# EAGLE design RGB LED 1.0 (EAGLE 5.04)
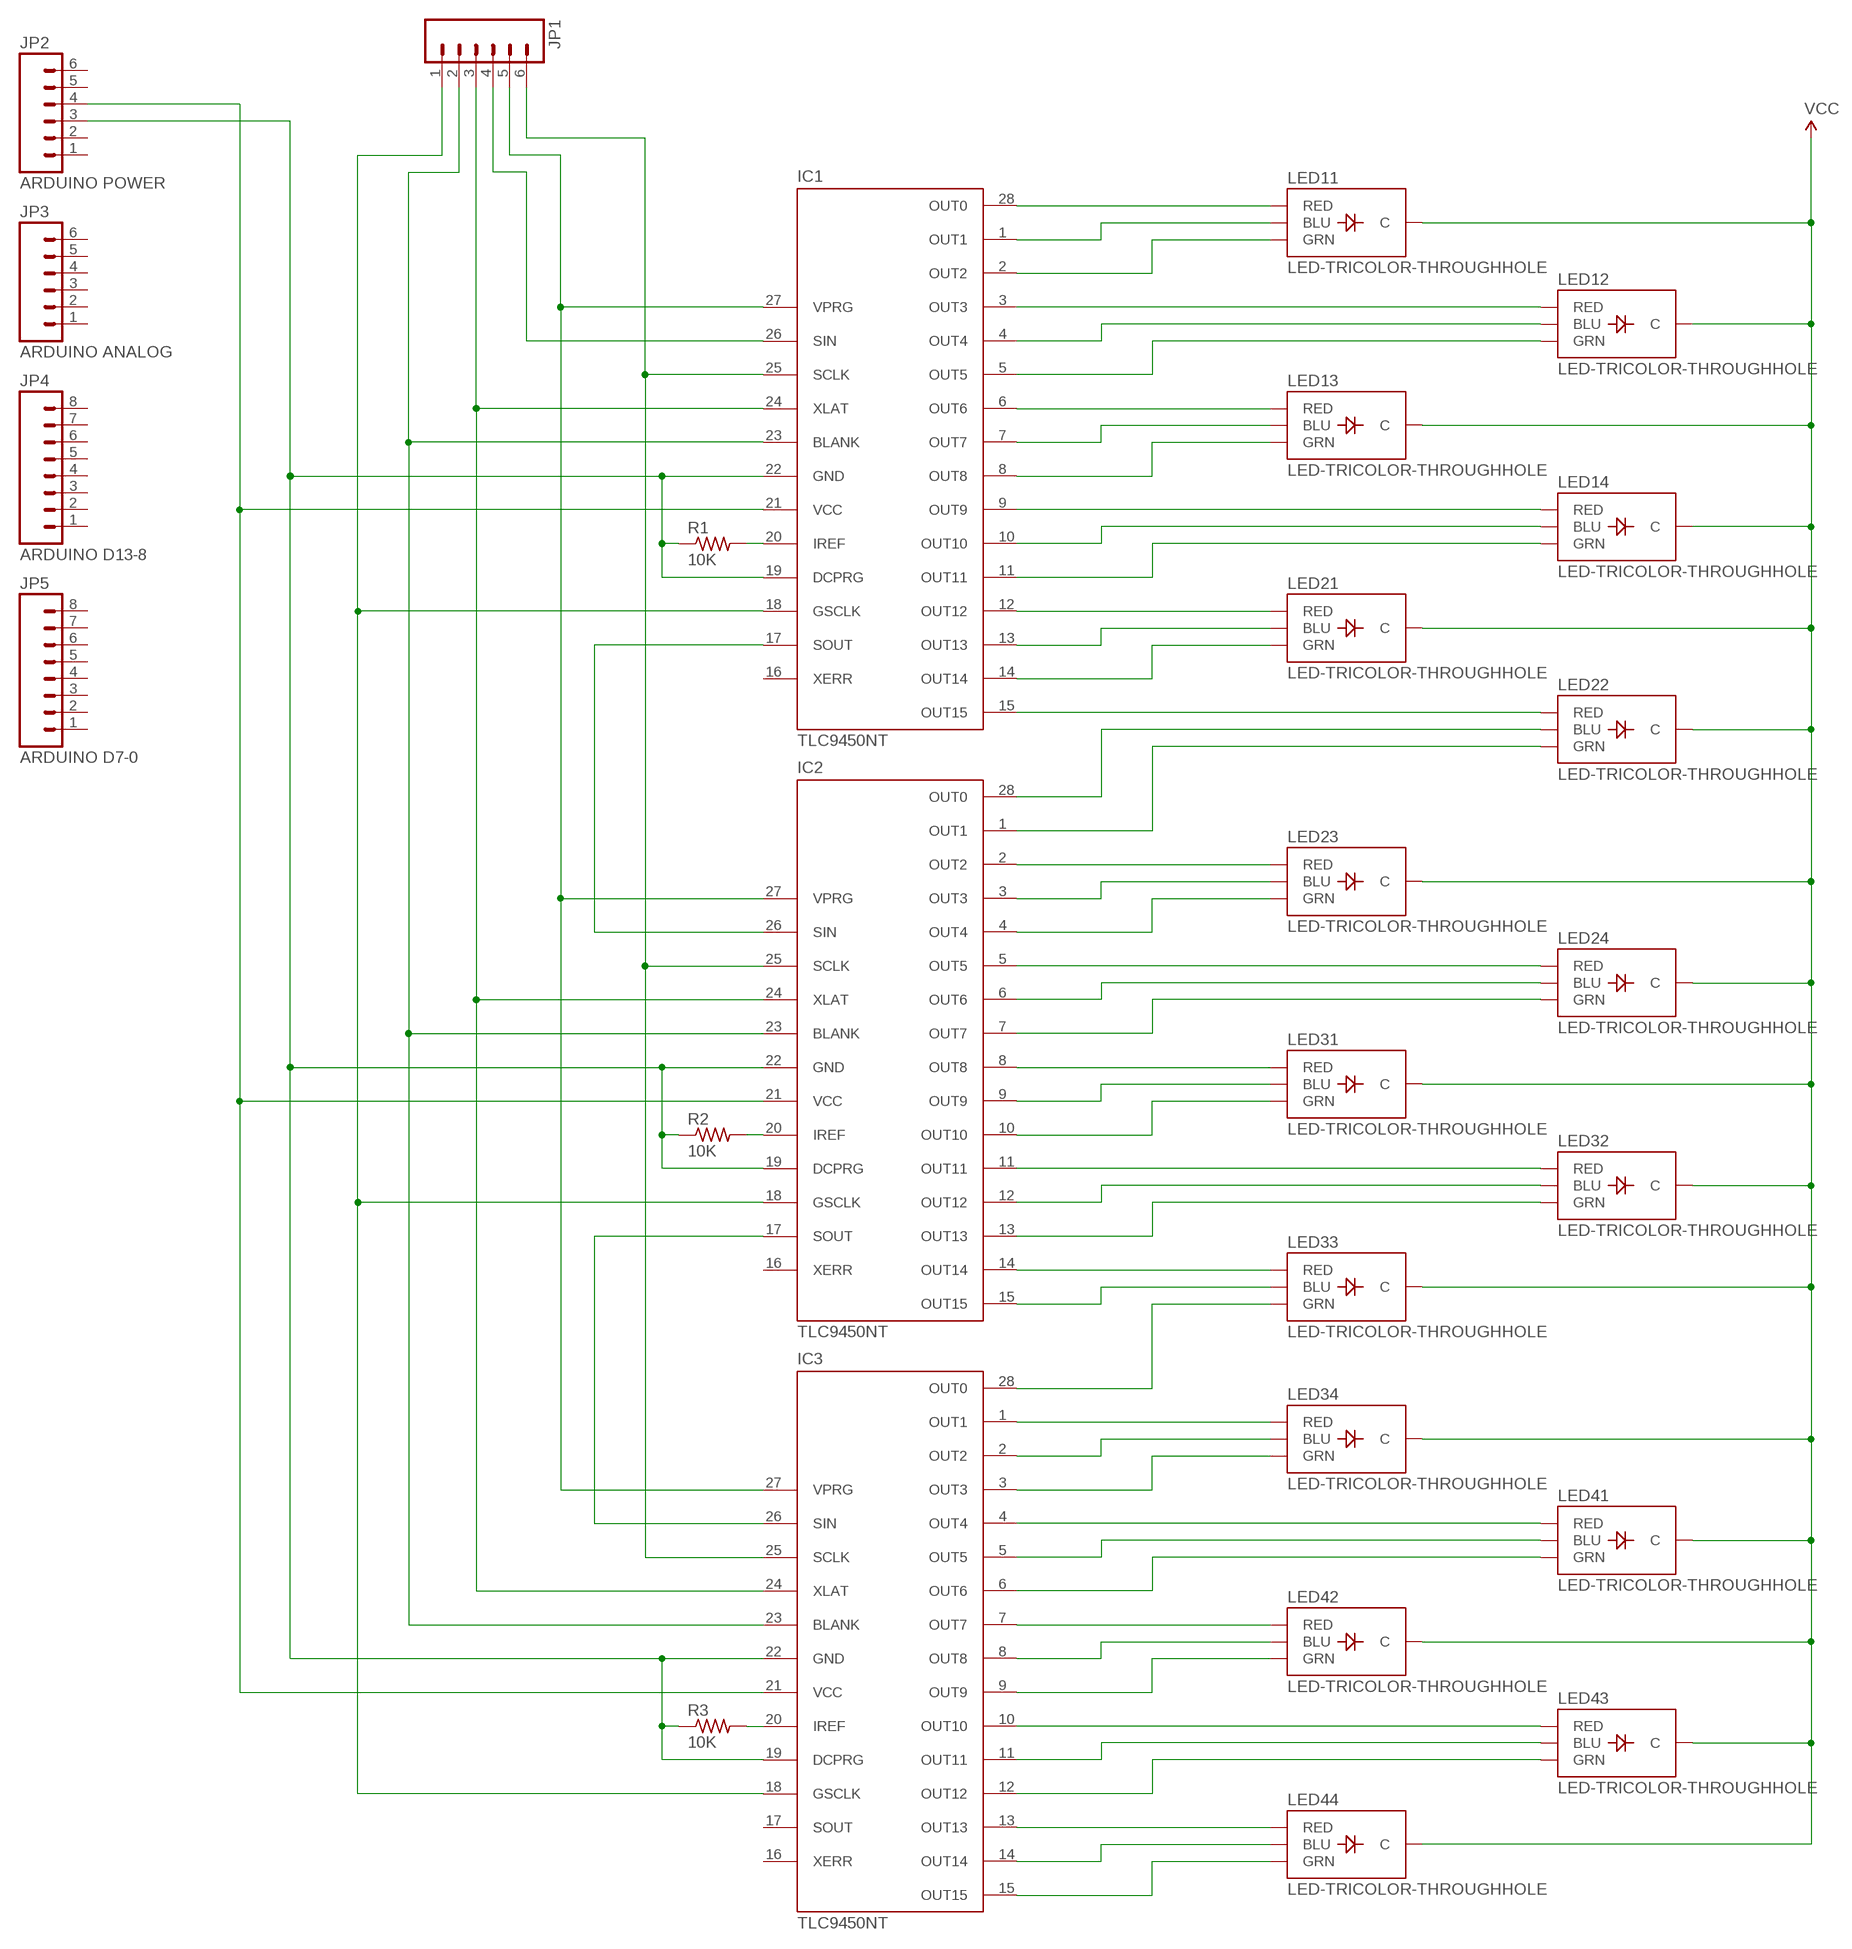
[diagram p0: schematic, sheet 1]

## Parts
IC1  TLC9450NT  [DIL28-3]
IC2  TLC9450NT  [DIL28-3]
IC3  TLC9450NT  [DIL28-3]
JP1  M06LOCK_LONGPADS  [1X06_LOCK_LONGPADS]
JP2  ARDUINO POWER  M06LOCK  [1X06_LOCK]
JP3  ARDUINO ANALOG  M06LOCK  [1X06_LOCK]
JP4  ARDUINO D13-8  M08LOCK  [1X08_LOCK]
JP5  ARDUINO D7-0  M08LOCK  [1X08_LOCK]
LED11  LED-TRICOLOR-THROUGHHOLE  [LED-TRICOLOR-THROUGHHOLE]
LED12  LED-TRICOLOR-THROUGHHOLE  [LED-TRICOLOR-THROUGHHOLE]
LED13  LED-TRICOLOR-THROUGHHOLE  [LED-TRICOLOR-THROUGHHOLE]
LED14  LED-TRICOLOR-THROUGHHOLE  [LED-TRICOLOR-THROUGHHOLE]
LED21  LED-TRICOLOR-THROUGHHOLE  [LED-TRICOLOR-THROUGHHOLE]
LED22  LED-TRICOLOR-THROUGHHOLE  [LED-TRICOLOR-THROUGHHOLE]
LED23  LED-TRICOLOR-THROUGHHOLE  [LED-TRICOLOR-THROUGHHOLE]
LED24  LED-TRICOLOR-THROUGHHOLE  [LED-TRICOLOR-THROUGHHOLE]
LED31  LED-TRICOLOR-THROUGHHOLE  [LED-TRICOLOR-THROUGHHOLE]
LED32  LED-TRICOLOR-THROUGHHOLE  [LED-TRICOLOR-THROUGHHOLE]
LED33  LED-TRICOLOR-THROUGHHOLE  [LED-TRICOLOR-THROUGHHOLE]
LED34  LED-TRICOLOR-THROUGHHOLE  [LED-TRICOLOR-THROUGHHOLE]
LED41  LED-TRICOLOR-THROUGHHOLE  [LED-TRICOLOR-THROUGHHOLE]
LED42  LED-TRICOLOR-THROUGHHOLE  [LED-TRICOLOR-THROUGHHOLE]
LED43  LED-TRICOLOR-THROUGHHOLE  [LED-TRICOLOR-THROUGHHOLE]
LED44  LED-TRICOLOR-THROUGHHOLE  [LED-TRICOLOR-THROUGHHOLE]
R1  10K  R-US_0309/12  [0309/12]
R2  10K  R-US_0309/12  [0309/12]
R3  10K  R-US_0309/12  [0309/12]

## Nets
BLANK: IC1.23(BLANK) IC2.23(BLANK) IC3.23(BLANK) JP1.2
GND: IC1.19(DCPRG) IC1.22(GND) IC2.19(DCPRG) IC2.22(GND) IC3.19(DCPRG) IC3.22(GND) JP2.3 R1.1 R2.1 R3.1
GSCLK: IC1.18(GSCLK) IC2.18(GSCLK) IC3.18(GSCLK) JP1.1
N$1: IC1.17(SOUT) IC2.26(SIN)
N$2: IC2.17(SOUT) IC3.26(SIN)
N$3: IC1.28(OUT0) LED11.RED
N$4: IC3.20(IREF) R3.2
N$5: IC2.20(IREF) R2.2
N$6: IC1.20(IREF) R1.2
N$7: IC1.1(OUT1) LED11.BLU
N$8: IC1.2(OUT2) LED11.GRN
N$9: IC1.3(OUT3) LED12.RED
N$10: IC1.4(OUT4) LED12.BLU
N$11: IC1.5(OUT5) LED12.GRN
N$12: IC1.6(OUT6) LED13.RED
N$13: IC1.7(OUT7) LED13.BLU
N$14: IC1.8(OUT8) LED13.GRN
N$16: IC1.10(OUT10) LED14.BLU
N$17: IC1.11(OUT11) LED14.GRN
N$18: IC1.12(OUT12) LED21.RED
N$19: IC1.13(OUT13) LED21.BLU
N$20: IC1.14(OUT14) LED21.GRN
N$21: IC1.15(OUT15) LED22.RED
N$22: IC2.28(OUT0) LED22.BLU
N$23: IC2.1(OUT1) LED22.GRN
N$24: IC2.2(OUT2) LED23.RED
N$25: IC2.3(OUT3) LED23.BLU
N$26: IC2.4(OUT4) LED23.GRN
N$27: IC2.5(OUT5) LED24.RED
N$28: IC2.6(OUT6) LED24.BLU
N$29: IC2.7(OUT7) LED24.GRN
N$30: IC2.8(OUT8) LED31.RED
N$31: IC2.9(OUT9) LED31.BLU
N$32: IC2.10(OUT10) LED31.GRN
N$33: IC2.11(OUT11) LED32.RED
N$34: IC2.12(OUT12) LED32.BLU
N$35: IC2.13(OUT13) LED32.GRN
N$36: IC2.14(OUT14) LED33.RED
N$37: IC2.15(OUT15) LED33.BLU
N$38: IC3.28(OUT0) LED33.GRN
N$39: IC3.1(OUT1) LED34.RED
N$40: IC3.2(OUT2) LED34.BLU
N$41: IC3.3(OUT3) LED34.GRN
N$42: IC3.4(OUT4) LED41.RED
N$43: IC3.5(OUT5) LED41.BLU
N$44: IC3.6(OUT6) LED41.GRN
N$45: IC3.7(OUT7) LED42.RED
N$46: IC3.8(OUT8) LED42.BLU
N$47: IC3.9(OUT9) LED42.GRN
N$48: IC3.10(OUT10) LED43.RED
N$49: IC3.11(OUT11) LED43.BLU
N$50: IC3.12(OUT12) LED43.GRN
N$51: IC3.13(OUT13) LED44.RED
N$52: IC3.14(OUT14) LED44.BLU
N$53: IC3.15(OUT15) LED44.GRN
NS$15: IC1.9(OUT9) LED14.RED
SCLK: IC1.25(SCLK) IC2.25(SCLK) IC3.25(SCLK) JP1.6
SIN: IC1.26(SIN) JP1.4
VCC: IC1.21(VCC) IC2.21(VCC) IC3.21(VCC) JP2.4 LED11.GND(C) LED12.GND(C) LED13.GND(C) LED14.GND(C) LED21.GND(C) LED22.GND(C) LED23.GND(C) LED24.GND(C) LED31.GND(C) LED32.GND(C) LED33.GND(C) LED34.GND(C) LED41.GND(C) LED42.GND(C) LED43.GND(C) LED44.GND(C)
VPRG: IC1.27(VPRG) IC2.27(VPRG) IC3.27(VPRG) JP1.5
XLAT: IC1.24(XLAT) IC2.24(XLAT) IC3.24(XLAT) JP1.3
Unconnected: IC1.16(XERR) IC2.16(XERR) IC3.16(XERR) IC3.17(SOUT) JP2.1 JP2.2 JP2.5 JP2.6 JP3.1 JP3.2 JP3.3 JP3.4 JP3.5 JP3.6 JP4.1 JP4.2 JP4.3 JP4.4 JP4.5 JP4.6 JP4.7 JP4.8 JP5.1 JP5.2 JP5.3 JP5.4 JP5.5 JP5.6 JP5.7 JP5.8

## Library data of the parts
IC1-IC3 = combee:TLC9450NT: TI TLC5940 16 Channel LED Driver
JP1-JP3 = SparkFun:M06: Header 6 Standard 6-pin 0.1" header. Use with straight break away headers (SKU : PRT-00116), right angle break away headers (PRT-00553), swiss pins (PRT-00743), machine pins (PRT-00117), and female headers (PRT-00115). Molex polarized connector foot print use with SKU : PRT-08094 with associated crimp pins and housings. NOTES ON THE VARIANTS LOCK and LOCK_LONGPADS... This footprint was designed to help hold the alignment of a through-hole component (i.e. 6-pin header) while soldering it into place. You may notice that each hole has been shifted either up or down by 0.005 of an inch from it's more standard position (which is a perfectly straight line). This slight alteration caused the pins (the squares in the middle) to touch the edges of the holes. Because they are alternating, it causes a "brace" to hold the component in place. 0.005 has proven to be the perfect amount of "off-center" position when using our standard breakaway headers. Although looks a little odd when you look at the bare footprint, once you have a header in there, the alteration is very hard to notice. Also, if you push a header all the way into place, it is covered up entirely on the bottom side. This idea of altering the position of holes to aid alignment will be further integrated into the Sparkfun Library for other footprints. It can help hold any component with 3 or more connection pins.
JP4 JP5 = SparkFun:M08: Header 8 Standard 8-pin 0.1" header. Use with straight break away headers (SKU : PRT-00116), right angle break away headers (PRT-00553), swiss pins (PRT-00743), machine pins (PRT-00117), and female headers (PRT-00115).
LED11-LED14 LED21-LED24 LED31-LED34 LED41-LED44 = SparkFun:LED-TRICOLOR-THROUGHHOLE
R1-R3 = resistor:R-US_: RESISTOR, American symbol

## Board
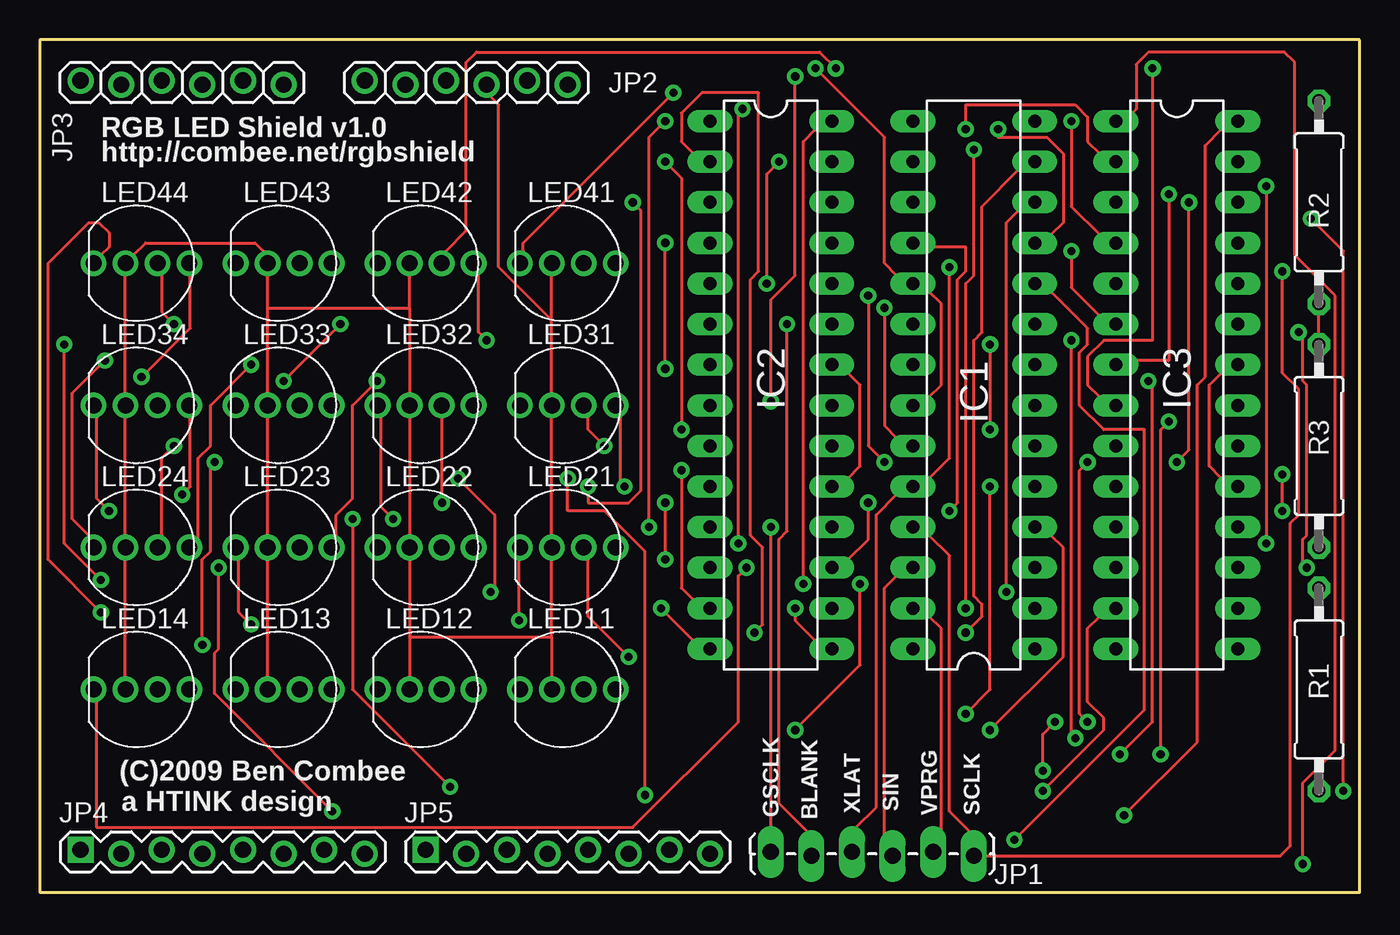
[diagram p1: board, top side]
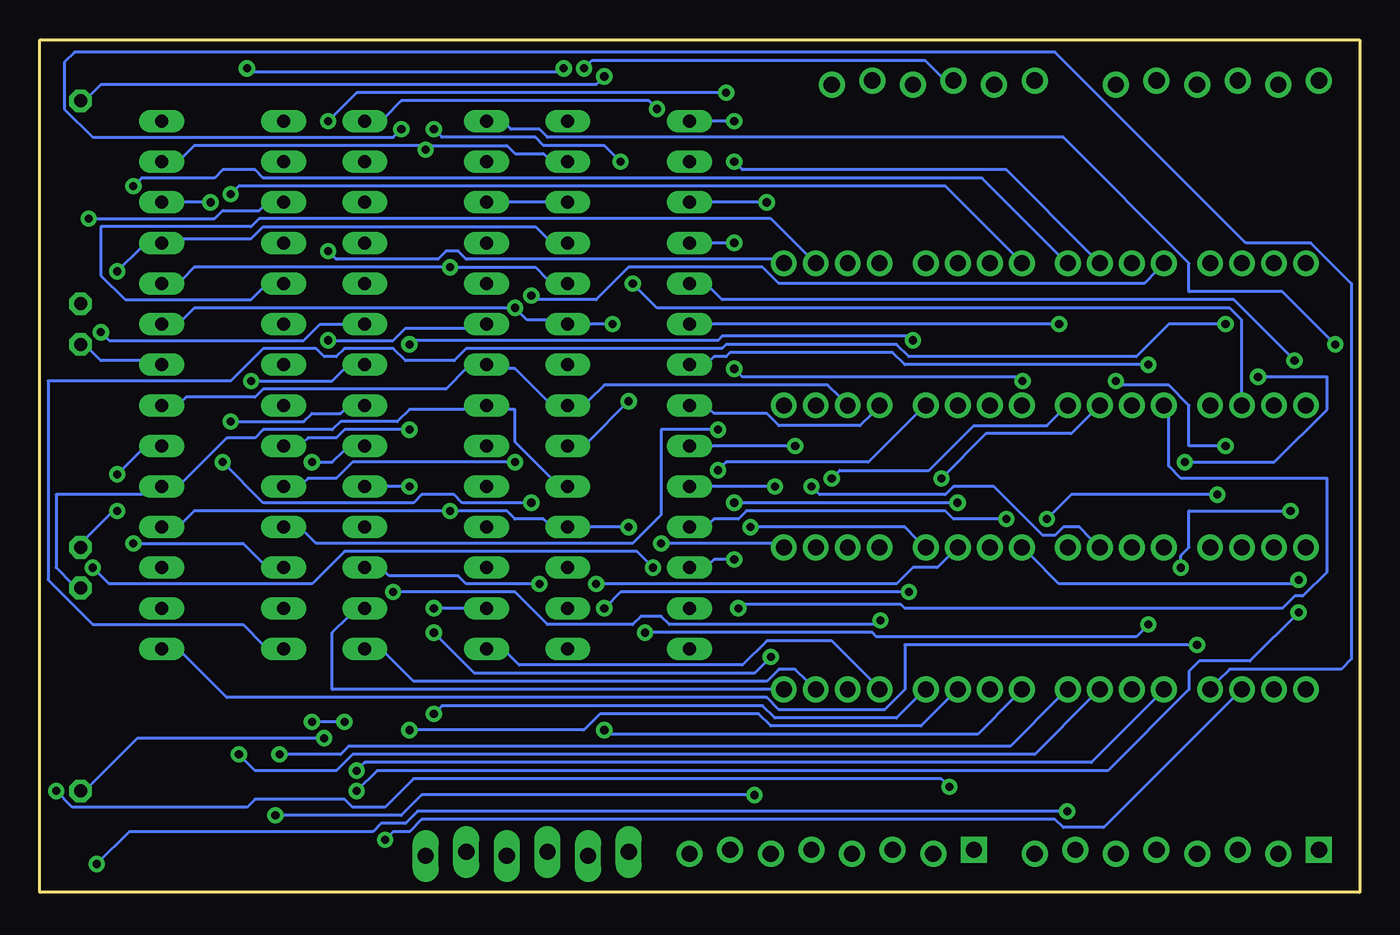
[diagram p2: board, bottom side, seen from below]

Size 82.55 x 53.34 mm. Coordinates in mm from the lower left corner, seen from the top.
Outline: 0,0 82.55,0 82.55,53.34 0,53.34 0,0
Copper layers (1*16): Top 0.035mm / dielectric 1.5mm / Bottom 0.035mm
Design rules "SparkFun": minimum track width 8mil, minimum drill 20mil, track to track 8mil, track to pad 8mil, pad to pad 8mil, via to via 8mil, smd to smd 8mil, copper to edge 10mil, drill to drill 8mil, minimum pad ring 12mil, minimum via ring 10mil, stop-mask expansion 4mil, vias tented up to drill 25mil, thermal gap 10mil

### Footprints (pad centres in the part's own frame; a part is rotated, then mirrored left to right if it is on the bottom)
DIL28-3 = drill 0.813 long: 1 -16.51,-3.81; 2 -13.97,-3.81; 3 -11.43,-3.81; 4 -8.89,-3.81; 5 -6.35,-3.81; 6 -3.81,-3.81; 7 -1.27,-3.81; 8 1.27,-3.81; 9 3.81,-3.81; 10 6.35,-3.81; 11 8.89,-3.81; 12 11.43,-3.81; 13 13.97,-3.81; 14 16.51,-3.81; 15 16.51,3.81; 16 13.97,3.81; 17 11.43,3.81; 18 8.89,3.81; 19 6.35,3.81; 20 3.81,3.81; 21 1.27,3.81; 22 -1.27,3.81; 23 -3.81,3.81; 24 -6.35,3.81; 25 -8.89,3.81; 26 -11.43,3.81; 27 -13.97,3.81; 28 -16.51,3.81
1X06_LOCK_LONGPADS = drill 1.016 long: 1 0,0; 2 2.54,-0.254; 3 5.08,0; 4 7.62,-0.254; 5 10.16,0; 6 12.7,-0.254
1X06_LOCK = drill 1.016 round: 1 0,0; 2 2.54,-0.254; 3 5.08,0; 4 7.62,-0.254; 5 10.16,0; 6 12.7,-0.254
1X08_LOCK = drill 1.016 square: 1 0,0.127 | drill 1.016 round: 2 2.54,-0.127; 3 5.08,0.127; 4 7.62,-0.127; 5 10.16,0.127; 6 12.7,-0.127; 7 15.24,0.127; 8 17.78,-0.127
LED-TRICOLOR-THROUGHHOLE = drill 1 round: BLU 1,0; GND -1,0; GRN 3,0; RED -3,0
0309/12 = drill 0.813 octagon: 1 -6.35,0; 2 6.35,0

### Placement (x,y rotation side)
IC1  58.42,31.75 90 top
IC2  45.72,31.75 270 top
IC3  71.12,31.75 270 top
JP1  45.72,2.54 0 top
JP2  20.32,50.8 0 top
JP3  2.54,50.8 0 top
JP4  2.54,2.54 0 top
JP5  24.13,2.54 0 top
LED11  33.02,12.7 0 top
LED12  24.13,12.7 0 top
LED13  15.24,12.7 0 top
LED14  6.35,12.7 0 top
LED21  33.02,21.59 0 top
LED22  24.13,21.59 0 top
LED23  15.24,21.59 0 top
LED24  6.35,21.59 0 top
LED31  33.02,30.48 0 top
LED32  24.13,30.48 0 top
LED33  15.24,30.48 0 top
LED34  6.35,30.48 0 top
LED41  33.02,39.37 0 top
LED42  24.13,39.37 0 top
LED43  15.24,39.37 0 top
LED44  6.35,39.37 0 top
R1  80.01,12.7 270 top
R2  80.01,43.18 90 top
R3  80.01,27.94 270 top

### Tracks (layer width: path | path; a pad name or v marks a point on that pad's centre or on a via)
BLANK  (via drill 0.51)
  Top 0.203: v52.83,36.58 52.83,29.21 53.59,28.45 IC1.23 | v46.74,35.56 46.74,22.61 46.23,22.1 46.23,5.59 48.01,3.81 JP1.2
  Bottom 0.203: IC3.23 73.66,35.81 72.9,36.58 v52.83,36.58 52.07,35.81 50.8,35.81 IC2.23 v46.74,35.56
GND  (via drill 0.51)
  Top 0.203: R3.1 R2.1 | IC3.19 73.91,25.91 73.15,26.67 73.15,31.75 73.91,32.51 IC3.22 | IC2.22 50.55,32.51 51.31,31.75 51.31,26.67 50.55,25.91 IC2.19 | IC1.22 55.63,30.99 56.39,31.75 56.39,36.83 55.63,37.59 IC1.19 53.59,38.61 52.83,39.37 52.83,47.24 v48.51,51.56
  Bottom 0.203: R1.1 80.52,19.3 81.53,20.32 81.53,24.89 75.95,24.89 IC3.19 73.66,25.65 70.87,28.45 69.09,28.45 68.58,28.96 64.26,28.96 63.75,29.46 60.2,29.46 59.44,30.23 55.88,30.23 IC1.22 53.34,30.23 52.83,30.23 52.83,28.19 50.55,25.91 IC2.19 | R3.1 79.5,34.04 78.74,33.27 76.2,33.27 IC3.22 | v48.51,51.56 48.01,52.07 27.18,52.07 26.16,51.05 JP2.3
GSCLK  (via drill 0.51)
  Top 0.203: v56.9,23.88 57.4,24.38 57.4,38.35 57.91,38.86 57.91,40.39 55.88,40.39 IC1.18 | JP1.1 v45.72,22.86
  Bottom 0.203: IC3.18 73.66,23.11 72.9,23.88 v56.9,23.88 53.34,23.88 52.83,23.37 51.05,23.37 50.8,23.11 IC2.18 v45.72,22.86
N$1
  Bottom 0.203: IC2.26 IC1.17
N$2  (via drill 0.51)
  Top 0.203: v51.82,24.38 51.82,22.1 50.55,20.83 IC2.17 | v71.12,26.92 71.88,27.69 v71.88,43.18
  Bottom 0.203: v51.82,24.38 56.13,24.38 56.64,24.89 58.67,24.89 59.18,24.38 68.58,24.38 v71.12,26.92 | v71.88,43.18 IC3.26
N$3
  Bottom 0.203: IC1.28 53.34,14.99 52.58,14.22 38.61,14.22 37.08,15.75 33.02,15.75 30.48,13.21 LED11.RED
N$4  (via drill 0.51)
  Top 0.203: v77.72,23.88 v77.72,26.16
  Bottom 0.203: v77.72,23.88 77.98,23.88 79.76,22.1 R3.2 | v77.72,26.16 76.2,27.69 IC3.20
N$5  (via drill 0.51)
  Top 0.203: v45.72,30.73 45.72,37.08 47.24,38.61 v47.24,51.05
  Bottom 0.203: v45.72,30.73 48.26,28.19 IC2.20 | v47.24,51.05 47.75,50.55 78.74,50.55 79.5,49.78 R2.2
N$6  (via drill 0.51)
  Top 0.203: v64.77,9.65 64.52,9.91 v64.52,34.54
  Bottom 0.203: v64.77,9.65 76.45,9.65 79.5,6.6 R1.2 | v64.52,34.54 60.45,34.54 59.69,35.31 55.88,35.31 IC1.20
N$7
  Bottom 0.203: IC1.1 60.96,14.99 59.18,13.21 37.08,13.21 36.32,13.97 35.31,13.97 34.54,13.21 LED11.BLU
N$8
  Bottom 0.203: IC1.2 63.25,17.27 64.26,16.26 64.26,12.7 LED11.GRN
N$9  (via drill 0.51)
  Top 0.203: v51.31,19.3 51.31,14.22 v47.24,10.16
  Bottom 0.203: v51.31,19.3 55.88,19.3 56.39,19.81 60.71,19.81 60.96,20.07 IC1.3 | v47.24,10.16 46.99,9.91 23.88,9.91 21.59,12.19 LED12.RED
N$10  (via drill 0.51)
  Top 0.203: v59.44,10.16 64.01,14.73 64.01,21.59 63.25,22.35 IC1.4
  Bottom 0.203: v59.44,10.16 48.51,10.16 47.5,11.18 37.59,11.18 36.83,10.41 27.43,10.41 25.65,12.19 LED12.BLU
N$11  (via drill 0.51)
  Top 0.203: v59.44,25.4 59.44,12.7 v57.91,11.18
  Bottom 0.203: v57.91,11.18 57.4,11.68 37.34,11.68 36.58,10.92 28.96,10.92 27.69,12.19 LED12.GRN | v59.44,25.4 IC1.5
N$12  (via drill 0.51)
  Top 0.203: v65.53,26.92 65.02,26.42 65.02,11.18 v65.53,10.67 | v63.5,10.67 62.74,9.91 v62.74,7.62
  Bottom 0.203: v65.53,26.92 64.26,26.92 63.5,27.69 IC1.6 | v63.5,10.67 v65.53,10.67 | v62.74,7.62 62.23,8.13 16.76,8.13 12.7,12.19 LED13.RED
N$13  (via drill 0.51)
  Top 0.203: v70.61,29.46 70.1,28.96 v70.1,8.64
  Bottom 0.203: v70.61,29.46 66.04,29.46 65.53,29.97 63.75,29.97 63.5,30.23 IC1.7 | v70.1,8.64 69.09,7.62 64.01,7.62 62.99,8.64 20.32,8.64 16.76,12.19 LED13.BLU
N$14  (via drill 0.51)
  Top 0.203: v69.34,32 69.6,31.75 69.6,10.67 v67.56,8.64
  Bottom 0.203: v69.34,32 64.26,32 63.5,32.77 IC1.8 | v67.56,8.64 63.75,8.64 63.25,9.14 21.84,9.14 18.8,12.19 LED13.GRN
N$16  (via drill 0.51)
  Top 0.203: v60.96,3.3 69.09,11.43 69.09,28.96 66.55,28.96 65.02,30.48 65.02,33.78 65.53,34.29 65.53,35.31 63.25,37.59 IC1.10
  Bottom 0.203: v60.96,3.3 60.45,3.81 59.44,3.81 58.67,4.57 19.05,4.57 18.54,4.06 16,4.06 7.87,12.19 LED14.BLU
N$17  (via drill 0.51)
  Top 0.203: v59.94,47.75 59.94,47.24 62.99,47.24 64.01,46.23 64.01,41.91 63.25,41.15 IC1.11
  Bottom 0.203: v59.94,47.75 60.45,47.24 79.25,47.24 81.03,49.02 81.03,51.94 80.39,52.58 19.05,52.58 7.11,40.64 3.05,40.64 0.51,38.1 0.51,14.61 1.14,13.97 8.13,13.97 8.89,13.21 LED14.GRN
N$18  (via drill 0.51)
  Top 0.203: v60.45,18.8 60.45,41.91 61.21,42.67 IC1.12 | v29.97,17.02 29.97,20.83 LED21.RED
  Bottom 0.203: v60.45,18.8 52.83,18.8 50.8,16.76 45.47,16.76 44.96,17.27 43.69,17.27 43.18,16.76 30.23,16.76 v29.97,17.02
N$19  (via drill 0.51)
  Top 0.203: v57.91,16.26 58.93,17.27 58.93,18.03 58.42,18.54 58.42,34.54 58.93,35.05 58.93,42.93 61.21,45.21 IC1.13 | v36.83,14.73 34.29,17.27 34.29,20.83 LED21.BLU
  Bottom 0.203: v57.91,16.26 55.37,13.72 37.85,13.72 v36.83,14.73
N$20  (via drill 0.51)
  Top 0.203: v43.94,49.02 43.69,48.77 v43.69,21.84
  Bottom 0.203: v43.94,49.02 44.45,49.53 59.94,49.53 60.96,48.51 IC1.14 | v43.69,21.84 36.58,21.84 LED21.GRN
N$21  (via drill 0.51)
  Top 0.203: v1.52,34.29 1.52,21.84 v3.81,19.56
  Bottom 0.203: v1.52,34.29 4.83,37.59 10.67,37.59 10.67,39.37 18.54,47.24 50.8,47.24 51.31,47.75 53.09,47.75 53.34,48.01 IC1.15 | v3.81,19.56 4.06,19.3 18.8,19.3 20.57,21.08 LED22.RED
N$22  (via drill 0.51)
  Top 0.203: v47.75,19.3 47.75,46.99 48.51,47.75 IC2.28
  Bottom 0.203: v47.75,19.3 28.96,19.3 27.94,20.32 26.42,20.32 25.65,21.08 LED22.BLU
N$23  (via drill 0.51)
  Top 0.203: v39.12,48.26 38.1,47.24 v38.1,22.86
  Bottom 0.203: v38.1,22.86 28.45,22.86 27.69,22.1 LED22.GRN | v39.12,48.26 IC2.1
N$24  (via drill 0.51)
  Top 0.203: v44.7,16.26 45.21,16.76 45.21,21.59 44.45,22.35 44.45,38.35 44.96,38.86 44.96,50.04 41.4,50.04 40.13,48.77 40.13,46.99 40.89,46.23 IC2.2 | v13.21,16.76 12.45,17.53 12.45,20.83 LED23.RED
  Bottom 0.203: v44.7,16.26 30.48,16.26 30.23,16 13.97,16 v13.21,16.76
N$25  (via drill 0.51)
  Top 0.203: v37.08,43.18 37.59,42.67 37.59,25.15 36.83,24.38 34.29,24.38 v34.29,25.4
  Bottom 0.203: v34.29,25.4 33.78,24.89 25.91,24.89 25.4,25.4 22.86,25.4 19.81,22.35 19.05,22.35 18.54,22.86 17.53,22.86 16.76,22.1 LED23.BLU | v37.08,43.18 IC2.3
N$26  (via drill 0.51)
  Top 0.203: v39.12,32.77 v39.12,40.64 | v21.08,32 19.56,30.48 19.56,24.64 18.54,23.62 18.54,22.35 LED23.GRN
  Bottom 0.203: v39.12,32.77 38.61,32.26 21.34,32.26 v21.08,32 | v39.12,40.64 IC2.4
N$27  (via drill 0.51)
  Top 0.203: v4.06,33.27 2.03,31.24 2.03,23.37 3.05,22.35 LED24.RED
  Bottom 0.203: v4.06,33.27 7.87,37.08 39.88,37.08 40.64,37.85 IC2.5
N$28  (via drill 0.51)
  Top 0.203: v15.24,32 v18.8,35.56 | v8.38,27.94 7.62,27.18 7.62,22.35 LED24.BLU
  Bottom 0.203: v15.24,32 14.99,31.75 11.94,31.75 10.67,30.48 10.67,27.94 v8.38,27.94 | v18.8,35.56 IC2.6
N$29  (via drill 0.51)
  Top 0.203: v13.21,33.02 10.67,30.48 10.67,27.94 9.91,27.18 9.91,22.1 LED24.GRN
  Bottom 0.203: v13.21,33.02 28.45,33.02 29.21,33.78 39.37,33.78 39.62,33.53 40.39,33.53 40.64,33.27 IC2.7
N$30
  Bottom 0.203: IC2.8 40.64,30.23 40.39,29.97 37.08,29.97 36.32,29.21 31.24,29.21 30.48,29.97 LED31.RED
N$31  (via drill 0.51)
  Top 0.203: v35.31,27.94 34.29,28.96 34.29,29.72 LED31.BLU
  Bottom 0.203: v35.31,27.94 IC2.9
N$32  (via drill 0.51)
  Top 0.203: v36.58,25.4 36.32,25.65 36.32,29.72 LED31.GRN
  Bottom 0.203: v36.58,25.4 IC2.10
N$33  (via drill 0.51)
  Top 0.203: v22.1,23.37 21.34,24.13 21.34,29.72 LED32.RED
  Bottom 0.203: v22.1,23.37 25.4,23.37 25.91,23.88 38.35,23.88 38.86,23.37 40.39,23.37 40.64,23.11 IC2.11
N$34  (via drill 0.51)
  Top 0.203: v39.12,24.38 v39.12,20.83 | v25.15,24.38 25.15,29.72 LED32.BLU
  Bottom 0.203: v39.12,20.83 40.39,20.83 40.64,20.57 IC2.12 | v25.15,24.38 v39.12,24.38
N$35  (via drill 0.51)
  Top 0.203: v40.13,26.42 40.13,19.05 40.89,18.29 IC2.13
  Bottom 0.203: v40.13,26.42 39.62,26.92 30.73,26.92 27.69,29.97 LED32.GRN
N$36  (via drill 0.51)
  Top 0.203: v38.86,17.78 40.89,15.75 IC2.14
  Bottom 0.203: v38.86,17.78 38.61,18.03 28.7,18.03 28.45,17.78 4.83,17.78 4.06,18.54 3.56,18.54 2.03,20.07 2.03,25.91 11.18,25.91 11.94,26.67 11.94,29.72 LED33.RED
N$37  (via drill 0.51)
  Top 0.203: v47.24,17.78 47.24,17.02 48.51,15.75 IC2.15 | v28.19,18.8 28.45,19.05 28.45,23.62 v26.16,25.91
  Bottom 0.203: v47.24,17.78 46.23,18.8 v28.19,18.8 | v26.16,25.91 23.37,28.7 18.03,28.7 16.76,29.97 LED33.BLU
N$38  (via drill 0.51)
  Top 0.203: v67.82,4.83 72.39,9.4 72.39,31.75 72.9,32.26 72.9,46.74 73.91,47.75 IC3.28 | v37.85,6.1 37.85,21.34 35.31,23.88 33.02,23.88 v33.02,25.91
  Bottom 0.203: v67.82,4.83 59.94,4.83 58.67,6.1 v37.85,6.1 | v33.02,25.91 32.51,26.42 26.92,26.42 24.13,29.21 19.56,29.21 18.8,29.97 LED33.GRN
N$39  (via drill 0.51)
  Top 0.203: v78.99,1.78 78.99,6.86 81.03,8.89 81.03,37.34 78.49,39.88 78.49,51.94 77.85,52.58 69.34,52.58 68.58,51.82 68.58,49.02 68.33,48.77 IC3.1 | v18.29,5.08 10.92,12.45 10.92,14.99 11.18,15.24 v11.18,20.32 | v4.32,23.88 3.56,24.64 3.56,29.72 LED34.RED
  Bottom 0.203: v78.99,1.78 76.96,3.81 61.72,3.81 61.21,4.32 59.69,4.32 58.93,5.08 v18.29,5.08 | v11.18,20.32 11.18,21.08 10.67,21.59 10.67,23.88 v4.32,23.88
N$40  (via drill 0.51)
  Top 0.203: v57.91,47.75 57.91,49.28 64.77,49.28 65.53,48.51 65.53,46.99 66.29,46.23 IC3.2 | v46.23,45.72 45.47,44.96 v45.47,38.1
  Bottom 0.203: v57.91,47.75 57.4,47.24 51.56,47.24 51.05,46.74 47.24,46.74 v46.23,45.72 | v45.47,38.1 43.94,36.58 8.13,36.58 7.37,35.81 7.37,31.24 LED34.BLU
N$41  (via drill 0.51)
  Top 0.203: v79.5,42.16 81.53,40.13 v81.53,6.35 | v25.65,6.6 19.56,12.7 v19.56,23.37 | v8.89,24.89 9.4,25.4 9.4,29.72 LED34.GRN
  Bottom 0.203: v79.5,42.16 71.63,42.16 71.12,42.67 68.83,42.67 68.58,42.93 IC3.3 | v81.53,6.35 80.52,5.33 69.6,5.33 69.09,5.84 63.5,5.84 62.99,5.33 60.96,5.33 59.18,7.11 26.16,7.11 v25.65,6.6 | v19.56,23.37 18.03,24.89 v8.89,24.89
N$42  (via drill 0.51)
  Top 0.203: v64.52,48.26 64.52,42.93 66.29,41.15 IC3.4 | v39.62,50.04 30.23,40.64 30.23,40.13 LED41.RED
  Bottom 0.203: v64.52,48.26 62.74,50.04 v39.62,50.04
N$43
  Bottom 0.203: IC3.5 68.58,37.85 69.34,37.08 77.22,37.08 78.74,38.61 78.74,41.66 69.34,41.66 68.83,42.16 36.83,42.16 34.54,39.88 LED41.BLU
N$44  (via drill 0.51)
  Top 0.203: v64.52,40.13 64.52,37.85 66.29,36.07 IC3.6
  Bottom 0.203: v64.52,40.13 64.01,39.62 57.66,39.62 57.15,40.13 56.39,40.13 55.88,39.62 36.58,39.62 LED41.GRN
N$45  (via drill 0.51)
  Top 0.203: v70.61,43.69 70.61,33.27 68.58,33.27 IC3.7
  Bottom 0.203: v70.61,43.69 70.1,44.2 25.91,44.2 21.59,39.88 LED42.RED
N$46  (via drill 0.51)
  Top 0.203: v69.6,51.56 69.6,34.54 66.55,34.54 65.53,33.53 65.53,31.75 66.29,30.99 IC3.8 | v49.78,51.56 48.77,52.58 27.3,52.58 26.67,51.94 26.67,41.4 25.4,40.13 LED42.BLU
  Bottom 0.203: v69.6,51.56 69.34,51.31 50.04,51.31 v49.78,51.56
N$47  (via drill 0.51)
  Top 0.203: v59.44,34.29 v59.44,28.96 | v27.94,34.54 27.43,35.05 27.43,38.61 LED42.GRN
  Bottom 0.203: v59.44,28.96 63.5,28.96 64.01,28.45 65.79,28.45 66.04,28.19 IC3.9 | v59.44,34.29 59.18,34.54 40.13,34.54 39.88,34.8 28.19,34.8 v27.94,34.54
N$48  (via drill 0.51)
  Top 0.203: v52.83,26.92 51.82,27.94 v51.82,37.34
  Bottom 0.203: v52.83,26.92 62.99,26.92 64.01,25.91 65.79,25.91 66.04,25.65 IC3.10 | v51.82,37.34 51.56,37.08 47.75,37.08 45.72,39.12 37.34,39.12 36.32,38.1 13.46,38.1 12.7,38.86 LED43.RED
N$49  (via drill 0.51)
  Top 0.203: v40.13,28.96 40.13,44.7 v39.12,45.72
  Bottom 0.203: v40.13,28.96 43.69,28.96 43.69,23.62 45.47,21.84 65.28,21.84 66.04,22.61 IC3.11 | v39.12,45.72 38.61,45.21 22.1,45.21 16.76,39.88 LED43.BLU
N$50  (via drill 0.51)
  Top 0.203: v76.71,44.2 v76.71,21.84
  Bottom 0.203: v76.71,21.84 69.85,21.84 68.58,20.57 IC3.12 | v76.71,44.2 76.2,44.7 71.63,44.7 71.12,45.21 69.09,45.21 68.58,44.7 23.62,44.7 18.8,39.88 LED43.GRN
N$51  (via drill 0.51)
  Top 0.203: v62.74,6.35 66.55,10.16 66.55,10.92 65.53,11.94 65.53,16.51 66.29,17.27 IC3.13 | v3.81,17.53 0.51,20.83 0.51,39.37 3.05,41.91 3.68,41.91 4.32,41.27 4.32,40.39 3.81,39.88 LED44.RED
  Bottom 0.203: v62.74,6.35 61.47,7.62 15.75,7.62 10.67,12.7 10.67,13.84 10.03,14.48 6.86,14.48 v3.81,17.53
N$52  (via drill 0.51)
  Top 0.203: v8.38,35.56 7.62,36.32 7.62,38.61 LED44.BLU
  Bottom 0.203: v8.38,35.56 11.94,35.56 13.97,33.53 28.19,33.53 28.96,34.29 39.62,34.29 39.88,34.04 55.88,34.04 56.64,33.27 59.69,33.27 60.45,34.04 63.5,34.04 64.01,33.53 64.77,33.53 65.28,34.04 68.58,34.04 70.61,32 82.04,32 82.04,19.56 79.25,16.76 69.85,16.76 68.58,15.49 IC3.14
N$53  (via drill 0.51)
  Top 0.203: v10.16,15.49 10.16,20.83 10.67,21.34 10.67,26.67 v10.92,26.92 | v6.35,32.26 9.4,35.31 9.4,38.61 LED44.GRN
  Bottom 0.203: v10.16,15.49 28.45,15.49 28.45,12.7 29.72,11.43 36.32,11.43 37.08,12.19 70.87,12.19 73.66,14.99 IC3.15 | v10.92,26.92 5.33,26.92 2.03,30.23 2.03,32.26 v6.35,32.26
NS$15  (via drill 0.51)
  Top 0.203: v78.74,35.05 78.99,34.8 78.99,32 79.25,31.75 79.25,22.35 78.99,22.1 78.99,20.57 v79.25,20.32 | v44.2,20.32 43.69,19.81 43.69,10.67 37.08,4.06 3.56,4.06 3.56,11.94 LED14.RED
  Bottom 0.203: v78.74,35.05 78.23,34.54 66.04,34.54 65.02,35.56 IC1.9 | v79.25,20.32 78.23,19.3 65.53,19.3 63.5,21.34 45.21,21.34 v44.2,20.32
SCLK  (via drill 0.51)
  Top 0.203: IC1.25 55.63,22.35 56.9,21.08 56.9,5.08 58.17,3.81 JP1.6 77.6,2.29 78.23,2.92 78.23,23.11 78.74,23.62 78.74,31.5 77.72,32.51 v77.72,38.86
  Bottom 0.203: IC2.25 50.8,40.89 51.56,41.66 68.58,41.66 69.34,40.89 73.66,40.89 IC3.25 76.2,40.39 v77.72,38.86
SIN
  Top 0.203: IC1.26 53.59,19.81 52.83,19.05 52.83,3.56 JP1.4
VCC
  Top 0.203: LED14.GND 5.33,13.46 5.33,20.83 LED24.GND 5.33,22.35 5.33,29.72 LED34.GND 5.33,31.24 5.33,38.61 LED44.GND 5.84,39.88 6.6,40.64 13.46,40.64 13.97,40.13 LED43.GND 14.22,38.61 14.22,36.58 | LED13.GND 14.22,13.46 14.22,20.83 LED23.GND 14.22,22.35 14.22,29.72 LED33.GND 14.22,31.24 14.22,36.58 | 23.11,16 23.11,20.83 LED22.GND 23.11,22.35 23.11,29.72 LED32.GND 23.11,31.24 23.11,36.58 | 23.11,16 23.11,13.46 LED12.GND | 23.11,36.58 23.11,38.61 LED42.GND | 32,16 32,20.83 LED21.GND 32,22.35 32,29.72 LED31.GND 32,31.24 32,35.81 | 32,16 32,13.46 LED11.GND | 32,35.81 32,38.61 LED41.GND | 32,35.81 28.7,39.12 28.7,49.28 28.19,49.78 JP2.4 | 23.11,16 32,16 | 14.22,36.58 23.11,36.58
  Bottom 0.203: IC3.21 73.66,30.73 73.41,30.99 69.09,30.99 68.58,31.5 57.15,31.5 55.88,32.77 IC1.21 53.34,32.77 52.83,32.77 50.8,30.73 IC2.21 48.26,30.73 47.24,31.75 33.27,31.75 32.51,30.99 LED31.GND
VPRG  (via drill 0.51)
  Top 0.203: IC1.27 55.63,17.27 56.39,16.51 56.39,3.81 JP1.5 | v57.91,17.78 57.91,38.1 58.42,38.61 v58.42,46.48
  Bottom 0.203: 58.42,46.74 72.9,46.74 73.66,45.97 IC3.27 | 58.42,46.74 53.34,46.74 52.83,46.23 51.05,46.23 50.8,45.97 IC2.27 | v58.42,46.48 58.42,46.74 | IC1.27 v57.91,17.78
XLAT  (via drill 0.51)
  Top 0.203: JP1.3 51.05,4.06 52.32,5.33 52.32,23.62 53.59,24.89 IC1.24 55.63,25.91 56.9,27.18 v56.9,39.12
  Bottom 0.203: IC2.24 50.8,38.35 51.56,39.12 v56.9,39.12 72.9,39.12 73.66,38.35 IC3.24

### Text on the board
tPlace: RGB LED Shield v1.0 | http://combee.net/rgbshield | (C)2009 Ben Combee | a HTINK design | GSCLK | BLANK | XLAT | SIN | VPRG | SCLK